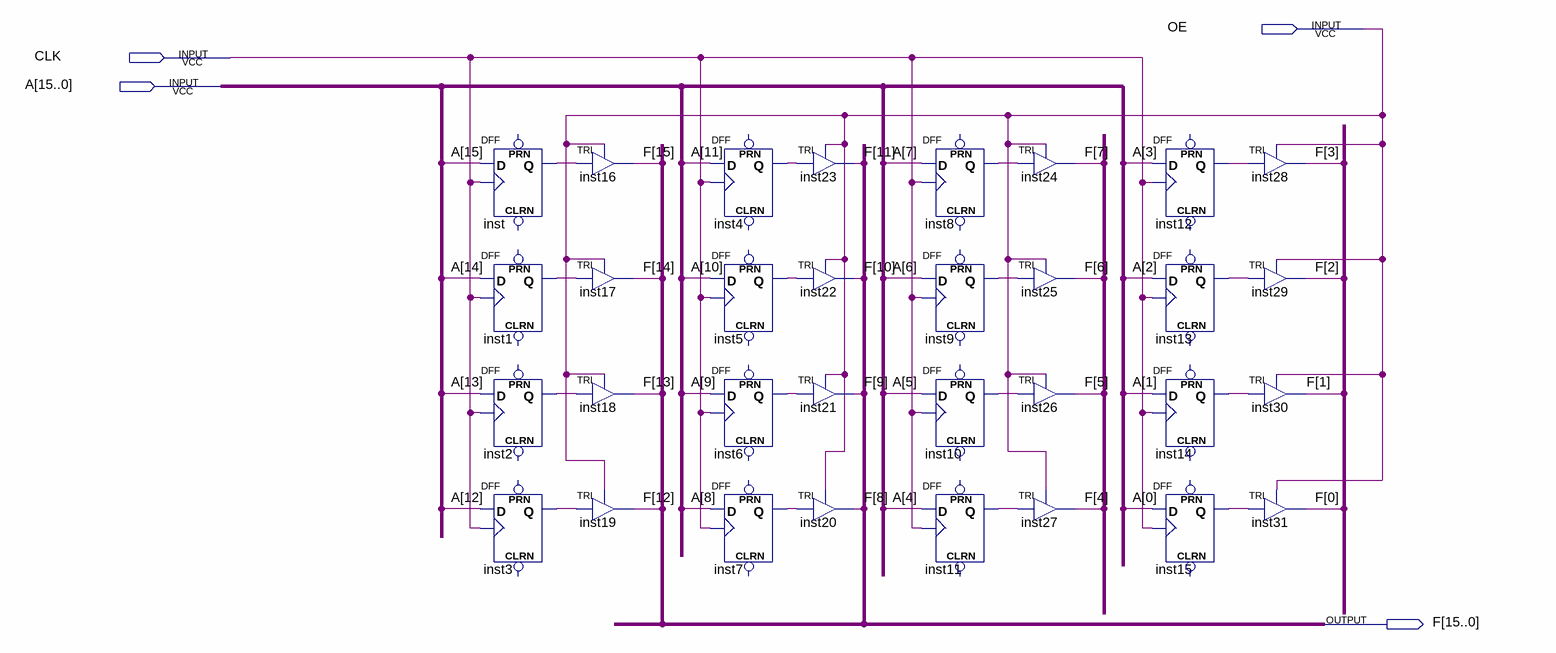
[diagram p0: schematic sheet]
// Quartus schematic register_OE.bdf as structural Verilog: 32 symbols, 4 pins
module register_OE (
  input  OE,
  input  CLK,
  input  [15:0] A,
  output [15:0] F
);

  wire inst1_q, inst2_q, inst3_q, inst4_q, inst5_q, inst6_q, inst7_q, inst8_q, inst9_q, inst10_q, inst11_q,
       inst12_q, inst13_q, inst14_q, inst15_q, inst_q;

  DFF inst (.CLK(CLK), .D(A[15]), .Q(inst_q));  // open: CLRN, PRN
  DFF inst1 (.CLK(CLK), .D(A[14]), .Q(inst1_q));  // open: CLRN, PRN
  DFF inst2 (.CLK(CLK), .D(A[13]), .Q(inst2_q));  // open: CLRN, PRN
  DFF inst3 (.CLK(CLK), .D(A[12]), .Q(inst3_q));  // open: CLRN, PRN
  TRI inst16 (.IN(inst_q), .OE(OE), .OUT(F[15]));
  TRI inst17 (.IN(inst1_q), .OE(OE), .OUT(F[14]));
  TRI inst18 (.IN(inst2_q), .OE(OE), .OUT(F[13]));
  TRI inst19 (.IN(inst3_q), .OE(OE), .OUT(F[12]));
  DFF inst4 (.CLK(CLK), .D(A[11]), .Q(inst4_q));  // open: CLRN, PRN
  DFF inst5 (.CLK(CLK), .D(A[10]), .Q(inst5_q));  // open: CLRN, PRN
  DFF inst6 (.CLK(CLK), .D(A[9]), .Q(inst6_q));  // open: CLRN, PRN
  DFF inst7 (.CLK(CLK), .D(A[8]), .Q(inst7_q));  // open: CLRN, PRN
  TRI inst23 (.IN(inst4_q), .OE(OE), .OUT(F[11]));
  TRI inst22 (.IN(inst5_q), .OE(OE), .OUT(F[10]));
  TRI inst21 (.IN(inst6_q), .OE(OE), .OUT(F[9]));
  TRI inst20 (.IN(inst7_q), .OE(OE), .OUT(F[8]));
  DFF inst8 (.CLK(CLK), .D(A[7]), .Q(inst8_q));  // open: CLRN, PRN
  DFF inst9 (.CLK(CLK), .D(A[6]), .Q(inst9_q));  // open: CLRN, PRN
  DFF inst10 (.CLK(CLK), .D(A[5]), .Q(inst10_q));  // open: CLRN, PRN
  DFF inst11 (.CLK(CLK), .D(A[4]), .Q(inst11_q));  // open: CLRN, PRN
  TRI inst24 (.IN(inst8_q), .OE(OE), .OUT(F[7]));
  TRI inst25 (.IN(inst9_q), .OE(OE), .OUT(F[6]));
  TRI inst26 (.IN(inst10_q), .OE(OE), .OUT(F[5]));
  TRI inst27 (.IN(inst11_q), .OE(OE), .OUT(F[4]));
  DFF inst12 (.CLK(CLK), .D(A[3]), .Q(inst12_q));  // open: CLRN, PRN
  DFF inst13 (.CLK(CLK), .D(A[2]), .Q(inst13_q));  // open: CLRN, PRN
  DFF inst14 (.CLK(CLK), .D(A[1]), .Q(inst14_q));  // open: CLRN, PRN
  DFF inst15 (.CLK(CLK), .D(A[0]), .Q(inst15_q));  // open: CLRN, PRN
  TRI inst28 (.IN(inst12_q), .OE(OE), .OUT(F[3]));
  TRI inst29 (.IN(inst13_q), .OE(OE), .OUT(F[2]));
  TRI inst30 (.IN(inst14_q), .OE(OE), .OUT(F[1]));
  TRI inst31 (.IN(inst15_q), .OE(OE), .OUT(F[0]));
endmodule
